# Altium schematic sheet io_bank.SchDoc
size A
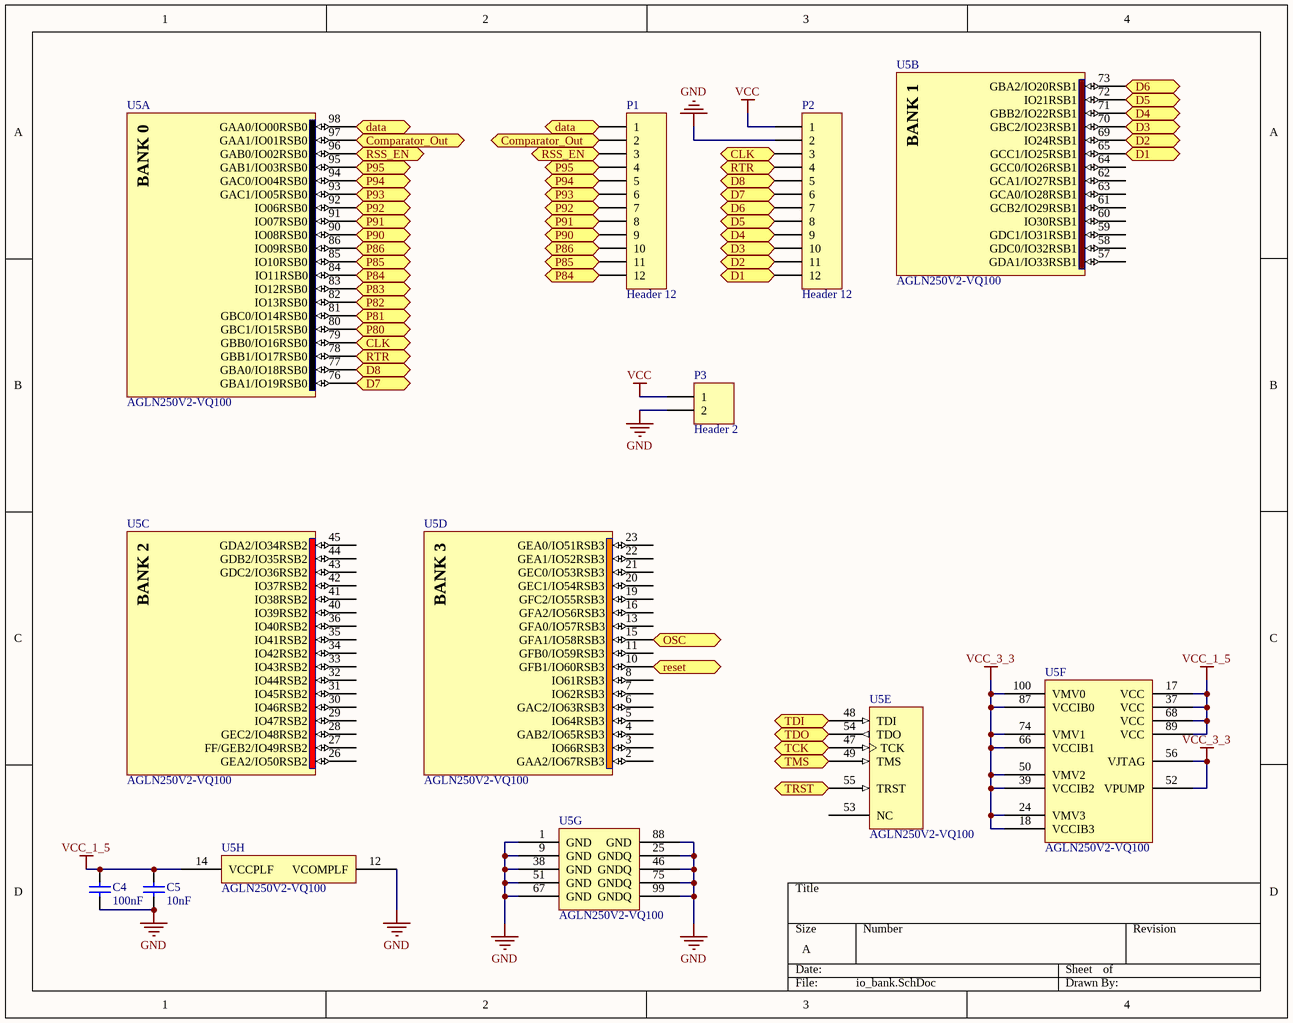
[diagram p0: io_bank.SchDoc]

## Parts
C4  value 100nF  [0603]  (hidden comment: Cap)
C5  value 10nF  [0603]  (hidden comment: Cap)
P1  Header 12  [HDR1X12]
P2  Header 12  [HDR1X12]
P3  Header 2  [HDR1X2]
U5  AGLN250V2-VQ100  [VQ100_N]  (parts A,B,C,D,E,F,G,H of 8)

## Ports
CLK, Comparator_Out, D1, D2, D3, D4, D5, D6, D7, D8, data, OSC, P80, P81, P82, P83, P84, P85, P86, P90, P91, P92, P93, P94, P95, reset, RSS_EN, RTR, TCK, TDI, TDO, TMS, TRST

## Nets
GND: C4.1 C5.1 P2.2 P3.2 U5.1(GND) U5.9(GND) U5.12(VCOMPLF) U5.25(GNDQ) U5.38(GND) U5.46(GNDQ) U5.51(GND) U5.67(GND) U5.75(GNDQ) U5.88(GND) U5.99(GNDQ)
VCC: P2.1 P3.1
VCC_1_5: C4.2 C5.2 U5.14(VCCPLF) U5.17(VCC) U5.37(VCC) U5.68(VCC) U5.89(VCC)
VCC_3_3: U5.18(VCCIB3) U5.24(VMV3) U5.39(VCCIB2) U5.50(VMV2) U5.52(VPUMP) U5.56(VJTAG) U5.66(VCCIB1) U5.74(VMV1) U5.87(VCCIB0) U5.100(VMV0)
CLK: P2.3 U5.79(GBB0/IO16RSB0) ; port CLK
Comparator_Out: P1.2 U5.97(GAA1/IO01RSB0) ; port Comparator_Out
D1: P2.12 U5.65(GCC1/IO25RSB1) ; port D1
D2: P2.11 U5.69(IO24RSB1) ; port D2
D3: P2.10 U5.70(GBC2/IO23RSB1) ; port D3
D4: P2.9 U5.71(GBB2/IO22RSB1) ; port D4
D5: P2.8 U5.72(IO21RSB1) ; port D5
D6: P2.7 U5.73(GBA2/IO20RSB1) ; port D6
D7: P2.6 U5.76(GBA1/IO19RSB0) ; port D7
D8: P2.5 U5.77(GBA0/IO18RSB0) ; port D8
data: P1.1 U5.98(GAA0/IO00RSB0) ; port data
OSC: U5.15(GFA1/IO58RSB3) ; port OSC
P80: U5.80(GBC1/IO15RSB0) ; port P80
P81: U5.81(GBC0/IO14RSB0) ; port P81
P82: U5.82(IO13RSB0) ; port P82
P83: U5.83(IO12RSB0) ; port P83
P84: P1.12 U5.84(IO11RSB0) ; port P84
P85: P1.11 U5.85(IO10RSB0) ; port P85
P86: P1.10 U5.86(IO09RSB0) ; port P86
P90: P1.9 U5.90(IO08RSB0) ; port P90
P91: P1.8 U5.91(IO07RSB0) ; port P91
P92: P1.7 U5.92(IO06RSB0) ; port P92
P93: P1.6 U5.93(GAC1/IO05RSB0) ; port P93
P94: P1.5 U5.94(GAC0/IO04RSB0) ; port P94
P95: P1.4 U5.95(GAB1/IO03RSB0) ; port P95
reset: U5.10(GFB1/IO60RSB3) ; port reset
RSS_EN: P1.3 U5.96(GAB0/IO02RSB0) ; port RSS_EN
RTR: P2.4 U5.78(GBB1/IO17RSB0) ; port RTR
TCK: U5.47(TCK) ; port TCK
TDI: U5.48(TDI) ; port TDI
TDO: U5.54(TDO) ; port TDO
TMS: U5.49(TMS) ; port TMS
TRST: U5.55(TRST) ; port TRST

Not connected (* = marked no-connect by the designer): U5 2(GAA2/IO67RSB3) 3(IO66RSB3) 4(GAB2/IO65RSB3) 5(IO64RSB3) 6(GAC2/IO63RSB3) 7(IO62RSB3) 8(IO61RSB3) 11(GFB0/IO59RSB3) 13(GFA0/IO57RSB3) 16(GFA2/IO56RSB3) 19(GFC2/IO55RSB3) 20(GEC1/IO54RSB3) 21(GEC0/IO53RSB3) 22(GEA1/IO52RSB3) 23(GEA0/IO51RSB3) 26(GEA2/IO50RSB2) 27(FF/GEB2/IO49RSB2) 28(GEC2/IO48RSB2) 29(IO47RSB2) 30(IO46RSB2) 31(IO45RSB2) 32(IO44RSB2) 33(IO43RSB2) 34(IO42RSB2) 35(IO41RSB2) 36(IO40RSB2) 40(IO39RSB2) 41(IO38RSB2) 42(IO37RSB2) 43(GDC2/IO36RSB2) 44(GDB2/IO35RSB2) 45(GDA2/IO34RSB2) 53(NC) 57(GDA1/IO33RSB1) 58(GDC0/IO32RSB1) 59(GDC1/IO31RSB1) 60(IO30RSB1) 61(GCB2/IO29RSB1) 62(GCA1/IO27RSB1) 63(GCA0/IO28RSB1) 64(GCC0/IO26RSB1)

## Notes on the sheet
- (in symbol AGLN250V2-VQ100, part A) BANK 0
- (in symbol AGLN250V2-VQ100, part B) BANK 1
- (in symbol AGLN250V2-VQ100, part C) BANK 2
- (in symbol AGLN250V2-VQ100, part D) BANK 3

## Library data of the parts
C4 C5 = Cap: Ceramic Capacitor (Surface Mount); Manufacturer: Generic Ceramic Chip Cap (TBD); Digi-Key Part Number: *; Manufacturer Part Number: *; Note: *; Rating: *
P1 P2 = Header 12: Header, 12-Pin; LatestRevisionDate: 17-Jul-2002; LatestRevisionNote: Re-released for DXP Platform.; Publisher: Altium Limited
P3 = Header 2: Header, 2-Pin; LatestRevisionDate: 17-Jul-2002; LatestRevisionNote: Re-released for DXP Platform.; Publisher: Altium Limited
U5 = AGLN250V2-VQ100: IGLOO nano Low-Power Flash 1.2 to 1.5V FPGA with Flash*Freeze, 68 User IOs, 250K System Gates, 1Kbit Flash ROM, 100-Pin TQFP, Commercial Grade; Published: 29-May-2009; LatestRevisionDate: 26-Feb-2010; LatestRevisionNote: Updated to datasheet version 0.8 Jan-2010.; DatasheetVersion: v0.8, Jan-2010; PackageVersion: ver11.2, Nov-2009; PackageReference: VQ100; Publisher: Altium Limited; PackageDescription: 100-Pin Plastic Quad Flat Pack (VQ100); Code_JEDEC: MS-026-AED; ComponentLink1Description: IGLOO nano Datasheet; ComponentLink1URL: http://www.actel.com/documents/IGLOO_nano_DS.pdf; ComponentLink2Description: Package Mechanical Drawings; ComponentLink2URL: http://www.actel.com/documents/PckgMechDrwngs.pdf; ComponentLink3Description: IGLOO nano Documents; ComponentLink3URL: http://www.actel.com/products/igloonano/docs.aspx; ComponentLink4Description: Actel.com Home; ComponentLink4URL: http://www.actel.com/